# EAGLE design ROm-el HN61256 Adapter_v2 (EAGLE 7.7.0)
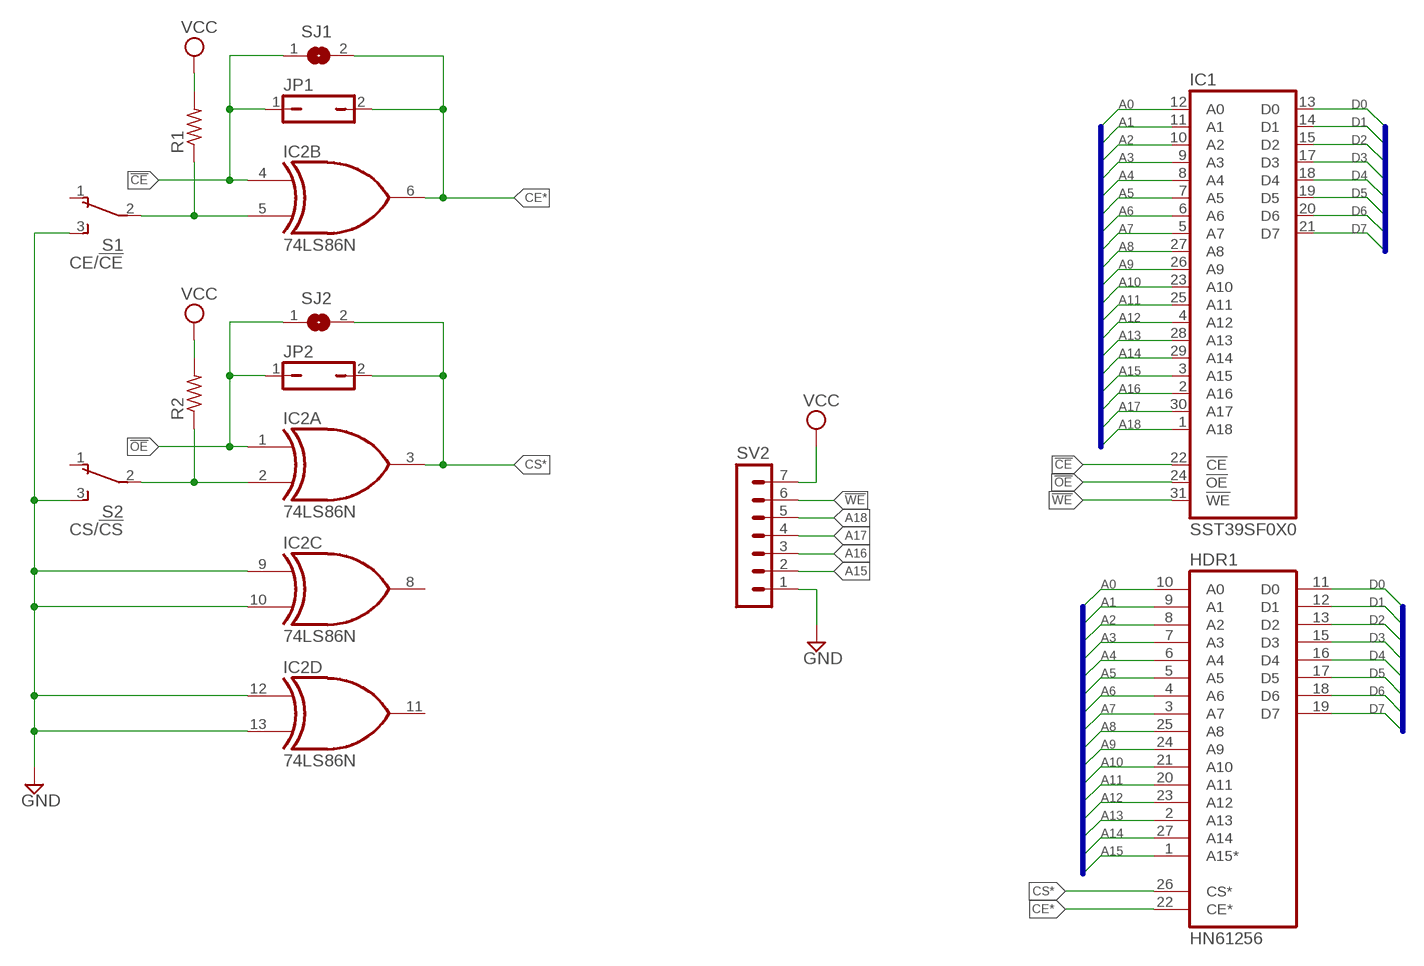
[diagram p0: schematic, sheet 1]

## Parts
HDR1  HN61256  [DIL28-6]
IC1  SST39SF0X0  SST39SF040APHR  [DIL32-RP]
IC2  74LS86N  [DIL14-RP]
JP1  JP1Q  [JP1]
JP2  JP1Q  [JP1]
R1  R-US_0204/5  [0204/5]
R2  R-US_0204/5  [0204/5]
S1  CE/!CE  TL36WO  [TL3XWO]
S2  CS/!CS  TL36WO  [TL3XWO]
SJ1  SJ  [SJ]
SJ2  SJ  [SJ]
SV2  MA07-1  [MA07-1]

## Nets
!CE: IC1.22(!CE) IC2.4(B:I0) JP1.1 SJ1.1
!OE: IC1.24(!OE) IC2.1(A:I0) JP2.1 SJ2.1
!WE: IC1.31(!WE) SV2.6
A0: HDR1.10(A0) IC1.12(A0)
A1: HDR1.9(A1) IC1.11(A1)
A2: HDR1.8(A2) IC1.10(A2)
A3: HDR1.7(A3) IC1.9(A3)
A4: HDR1.6(A4) IC1.8(A4)
A5: HDR1.5(A5) IC1.7(A5)
A6: HDR1.4(A6) IC1.6(A6)
A7: HDR1.3(A7) IC1.5(A7)
A8: HDR1.25(A8) IC1.27(A8)
A9: HDR1.24(A9) IC1.26(A9)
A10: HDR1.21(A10) IC1.23(A10)
A11: HDR1.20(A11) IC1.25(A11)
A12: HDR1.23(A12) IC1.4(A12)
A13: HDR1.2(A13) IC1.28(A13)
A14: HDR1.27(A14) IC1.29(A14)
A15: HDR1.1(A15*) IC1.3(A15) SV2.2
A16: IC1.2(A16) SV2.3
A17: IC1.30(A17) SV2.4
A18: IC1.1(A18) SV2.5
CE*: HDR1.22(CE*) IC2.6(B:O) JP1.2 SJ1.2
CS*: HDR1.26(CS*) IC2.3(A:O) JP2.2 SJ2.2
D0: HDR1.11(D0) IC1.13(D0)
D1: HDR1.12(D1) IC1.14(D1)
D2: HDR1.13(D2) IC1.15(D2)
D3: HDR1.15(D3) IC1.17(D3)
D4: HDR1.16(D4) IC1.18(D4)
D5: HDR1.17(D5) IC1.19(D5)
D6: HDR1.18(D6) IC1.20(D6)
D7: HDR1.19(D7) IC1.21(D7)
GND: IC2.9(C:I0) IC2.10(C:I1) IC2.12(D:I0) IC2.13(D:I1) S1.3(S) S2.3(S) SV2.1
N$4: IC2.2(A:I1) R2.1 S2.2(P)
N$5: IC2.5(B:I1) R1.1 S1.2(P)
VCC: R1.2 R2.2 SV2.7
Unconnected: IC2.8(C:O) IC2.11(D:O) S1.1(O) S2.1(O)

## Buses
A[0..18]
D[0..7]

## Power pins joined to a net without a drawn wire
GND: HDR1.14(GND) IC1.16(GND) IC2.7(P:GND)
VCC: HDR1.28(VCC) IC1.32(VCC) IC2.14(P:VCC)

## Library data of the parts
HDR1 = memory-hitachi-jlb:HN61256
IC1 = memory-sst:SST39SF040A: 4 Mbit x8 Multi-Purpose Flash Source: http://www.sst.com/dotAsset/40782.pdf
IC2 = 74xx-us-jlb:74*86: Quad 2-input EXCLUSIV-OR (XOR) gate
JP1 JP2 = jumper-jlb:JP1Q: JUMPER
R1 R2 = resistor:R-US_: RESISTOR, American symbol
S1 S2 = switch:TL36WO: TINY SWITCH ON - ON Source: http://www2.produktinfo.conrad.com/datenblaetter/700000-724999/705152-da-01-de-Subminiaturschalter_TL_36WO.pdf
SJ1 SJ2 = jumper-jlb:SJ: SMD solder JUMPER
SV2 = con-lstb-rp:MA07-1: PIN HEADER; OC_FARNELL: unknown; OC_NEWARK: unknown

## Board
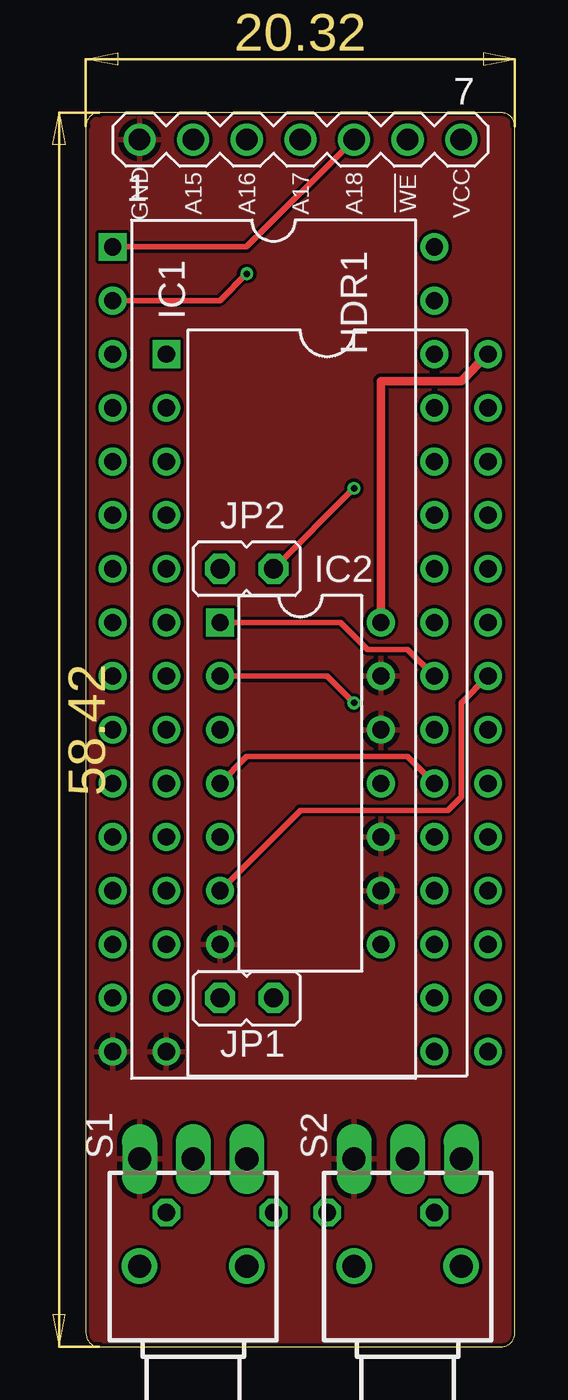
[diagram p1: board, top side]
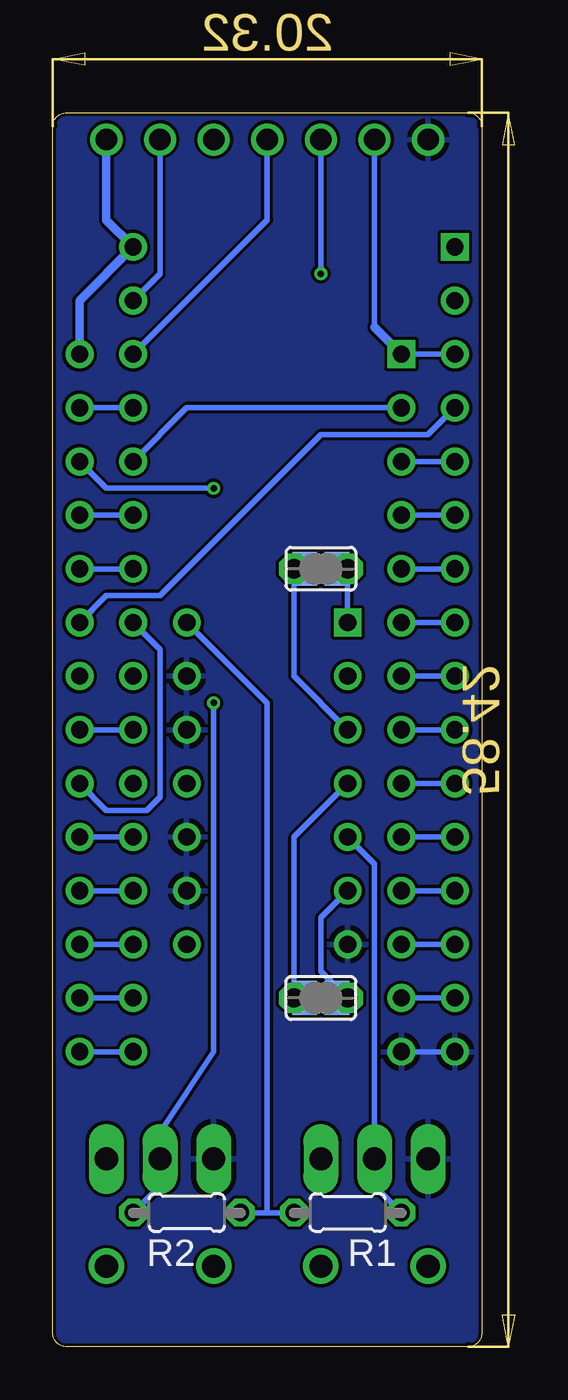
[diagram p2: board, bottom side, seen from below]

Size 20.32 x 58.42 mm. Coordinates in mm from the lower left corner, seen from the top.
Outline: 0,57.78 0,0.63 arc90 0.63,0 19.69,0 arc90 20.32,0.63 20.32,57.78 arc90 19.69,58.42 0.63,58.42 arc90 0,57.78
Copper layers (1*16): Top 0.035mm / dielectric 1.5mm / Bottom 0.035mm
Design rules "hackvana": minimum track width 6mil, minimum drill 0.3mm, track to track 6mil, track to pad 6mil, pad to pad 6mil, via to via 6mil, smd to smd 0mil, copper to edge 6mil, drill to drill 6mil, minimum pad ring 10mil, minimum via ring 6mil, stop-mask expansion 2mil, vias tented up to drill 100mil, thermal gap 10mil

### Footprints (pad centres in the part's own frame; a part is rotated, then mirrored left to right if it is on the bottom)
DIL28-6 = drill 0.813 square: 1 -16.51,-7.62 | drill 0.813: 2 -13.97,-7.62; 3 -11.43,-7.62; 4 -8.89,-7.62; 5 -6.35,-7.62; 6 -3.81,-7.62; 7 -1.27,-7.62; 8 1.27,-7.62; 9 3.81,-7.62; 10 6.35,-7.62; 11 8.89,-7.62; 12 11.43,-7.62; 13 13.97,-7.62; 14 16.51,-7.62; 15 16.51,7.62; 16 13.97,7.62; 17 11.43,7.62; 18 8.89,7.62; 19 6.35,7.62; 20 3.81,7.62; 21 1.27,7.62; 22 -1.27,7.62; 23 -3.81,7.62; 24 -6.35,7.62; 25 -8.89,7.62; 26 -11.43,7.62; 27 -13.97,7.62; 28 -16.51,7.62
DIL32-RP = drill 0.813 square: 1 -19.05,-7.62 | drill 0.813: 2 -16.51,-7.62; 3 -13.97,-7.62; 4 -11.43,-7.62; 5 -8.89,-7.62; 6 -6.35,-7.62; 7 -3.81,-7.62; 8 -1.27,-7.62; 9 1.27,-7.62; 10 3.81,-7.62; 11 6.35,-7.62; 12 8.89,-7.62; 13 11.43,-7.62; 14 13.97,-7.62; 15 16.51,-7.62; 16 19.05,-7.62; 17 19.05,7.62; 18 16.51,7.62; 19 13.97,7.62; 20 11.43,7.62; 21 8.89,7.62; 22 6.35,7.62; 23 3.81,7.62; 24 1.27,7.62; 25 -1.27,7.62; 26 -3.81,7.62; 27 -6.35,7.62; 28 -8.89,7.62; 29 -11.43,7.62; 30 -13.97,7.62; 31 -16.51,7.62; 32 -19.05,7.62
DIL14-RP = drill 0.813 square: 1 -7.62,-3.81 | drill 0.813: 2 -5.08,-3.81; 3 -2.54,-3.81; 4 0,-3.81; 5 2.54,-3.81; 6 5.08,-3.81; 7 7.62,-3.81; 8 7.62,3.81; 9 5.08,3.81; 10 2.54,3.81; 11 0,3.81; 12 -2.54,3.81; 13 -5.08,3.81; 14 -7.62,3.81
JP1 = drill 0.914 octagon: 1 0,-1.27; 2 0,1.27
0204/5 = drill 0.813 octagon: 1 -2.54,0; 2 2.54,0
TL3XWO = drill 1.1 pad 1.422 long: 1 -2.54,-5.08; 2 0,-5.08; 3 2.54,-5.08 | drill 1.1 pad 1.676: M1 -2.54,0; M2 2.54,0
SJ = smd 1.168 x 1.6: 1 -0.762,0; 2 0.762,0
MA07-1 = drill 1.016: 1 -7.62,0; 2 -5.08,0; 3 -2.54,0; 4 0,0; 5 2.54,0; 6 5.08,0; 7 7.62,0

### Placement (x,y rotation side)
HDR1  11.43,30.48 270 top
IC1  8.89,33.02 270 top
IC2  10.16,26.67 270 top
JP1  7.62,16.51 90 top
JP2  7.62,36.83 270 top
R1  6.35,6.35 180 bottom
R2  13.97,6.35 0 bottom
S1  5.08,3.81 180 top
S2  15.24,3.81 180 top
SJ1  7.62,16.51 0 bottom
SJ2  7.62,36.83 180 bottom
SV2  10.16,57.15 0 top

### Tracks (layer width: path | path; a pad name or v marks a point on that pad's centre or on a via)
!CE
  Top 0.254: IC1.22 15.24,27.94 7.62,27.94 IC2.4
  Bottom 0.254: IC2.4 8.89,24.13 JP1.1 SJ1.1
!OE
  Top 0.254: IC2.1 12.06,34.29 13.34,33.02 15.24,33.02 IC1.24
  Bottom 0.254: IC2.1 JP2.1 SJ2.1
!WE
  Bottom 0.254: IC1.31 15.24,50.8 SV2.6
A0
  Bottom 0.254: IC1.12 HDR1.10
A1
  Bottom 0.254: HDR1.9 IC1.11
A2
  Bottom 0.254: IC1.10 HDR1.8
A3
  Bottom 0.254: IC1.9 HDR1.7
A4
  Bottom 0.254: HDR1.6 IC1.8
A5
  Bottom 0.254: IC1.7 HDR1.5
A6
  Bottom 0.254: IC1.6 HDR1.4
A7
  Bottom 0.254: IC1.5 HDR1.3
A8
  Bottom 0.254: IC1.27 HDR1.25
A9
  Bottom 0.254: HDR1.24 IC1.26
A10
  Bottom 0.254: IC1.23 HDR1.21
A11
  Bottom 0.254: IC1.25 15.24,33.02 15.24,26.04 15.88,25.4 17.78,25.4 HDR1.20
A12
  Bottom 0.254: IC1.4 2.54,43.18 7.62,43.18 15.24,35.56 17.78,35.56 HDR1.23
A13
  Bottom 0.254: HDR1.2 13.97,44.45 IC1.28
A14
  Bottom 0.254: IC1.29 HDR1.27
A15
  Bottom 0.254: IC1.3 HDR1.1 | SV2.2 5.08,48.26
  Bottom 0.406: 5.08,48.26 HDR1.1
A16  (via drill 0.3)
  Top 0.254: IC1.2 6.35,49.53 v7.62,50.8
  Bottom 0.254: v7.62,50.8 SV2.3
A17
  Bottom 0.254: IC1.30 10.16,53.34 SV2.4
A18
  Top 0.254: IC1.1 7.62,52.07 SV2.5
CE*
  Top 0.254: HDR1.22 17.78,30.48 17.78,26.04 17.14,25.4 10.16,25.4 IC2.6
  Bottom 0.254: IC2.6 7.62,20.32 7.62,17.78 JP1.2 SJ1.2
CS*  (via drill 0.3)
  Top 0.254: v12.7,40.64 JP2.2
  Bottom 0.254: HDR1.26 17.78,40.64 v12.7,40.64 | IC2.3 8.89,31.75 JP2.2 SJ2.2
D0
  Bottom 0.254: IC1.13 HDR1.11
D1
  Bottom 0.254: HDR1.12 IC1.14
D2
  Bottom 0.254: IC1.15 HDR1.13
D3
  Bottom 0.254: HDR1.15 IC1.17
D4
  Bottom 0.254: IC1.18 HDR1.16
D5
  Bottom 0.254: HDR1.17 IC1.19
D6
  Bottom 0.254: IC1.20 HDR1.18
D7
  Bottom 0.254: HDR1.19 IC1.21
GND
  Bottom 0.254: IC1.16 HDR1.14
  pour Bottom: 20.32,57.78 20.32,0.63 arc-90 19.69,0 0.63,0 arc-90 0,0.63 0,57.78 arc-90 0.63,58.42 19.69,58.42 arc-90
  pour Top: 20.32,57.78 20.32,0.63 arc-90 19.69,0 0.63,0 arc-90 0,0.63 0,57.78 arc-90 0.63,58.42 19.69,58.42 arc-90
N$4  (via drill 0.3)
  Top 0.254: IC2.2 11.43,31.75 v12.7,30.48
  Bottom 0.254: R2.1 15.24,7.62 S2.2 15.24,10.16 12.7,13.97 v12.7,30.48
N$5
  Bottom 0.254: IC2.5 5.08,22.86 S1.2 5.08,7.62 R1.1
VCC
  Top 0.406: HDR1.28 17.78,45.72 13.97,45.72 IC2.14
  Bottom 0.254: IC2.14 10.16,30.48 10.16,6.35 | 10.16,6.35 R1.2 | R2.2 10.16,6.35
  Bottom 0.406: HDR1.28 19.05,49.53 IC1.32 17.78,53.34 SV2.7

### Text on the board
tNames: GND | A15 | A16 | A17 | A18 | !WE | VCC